# Altium project Cabinet.PrjPCB (part 1 of 2)
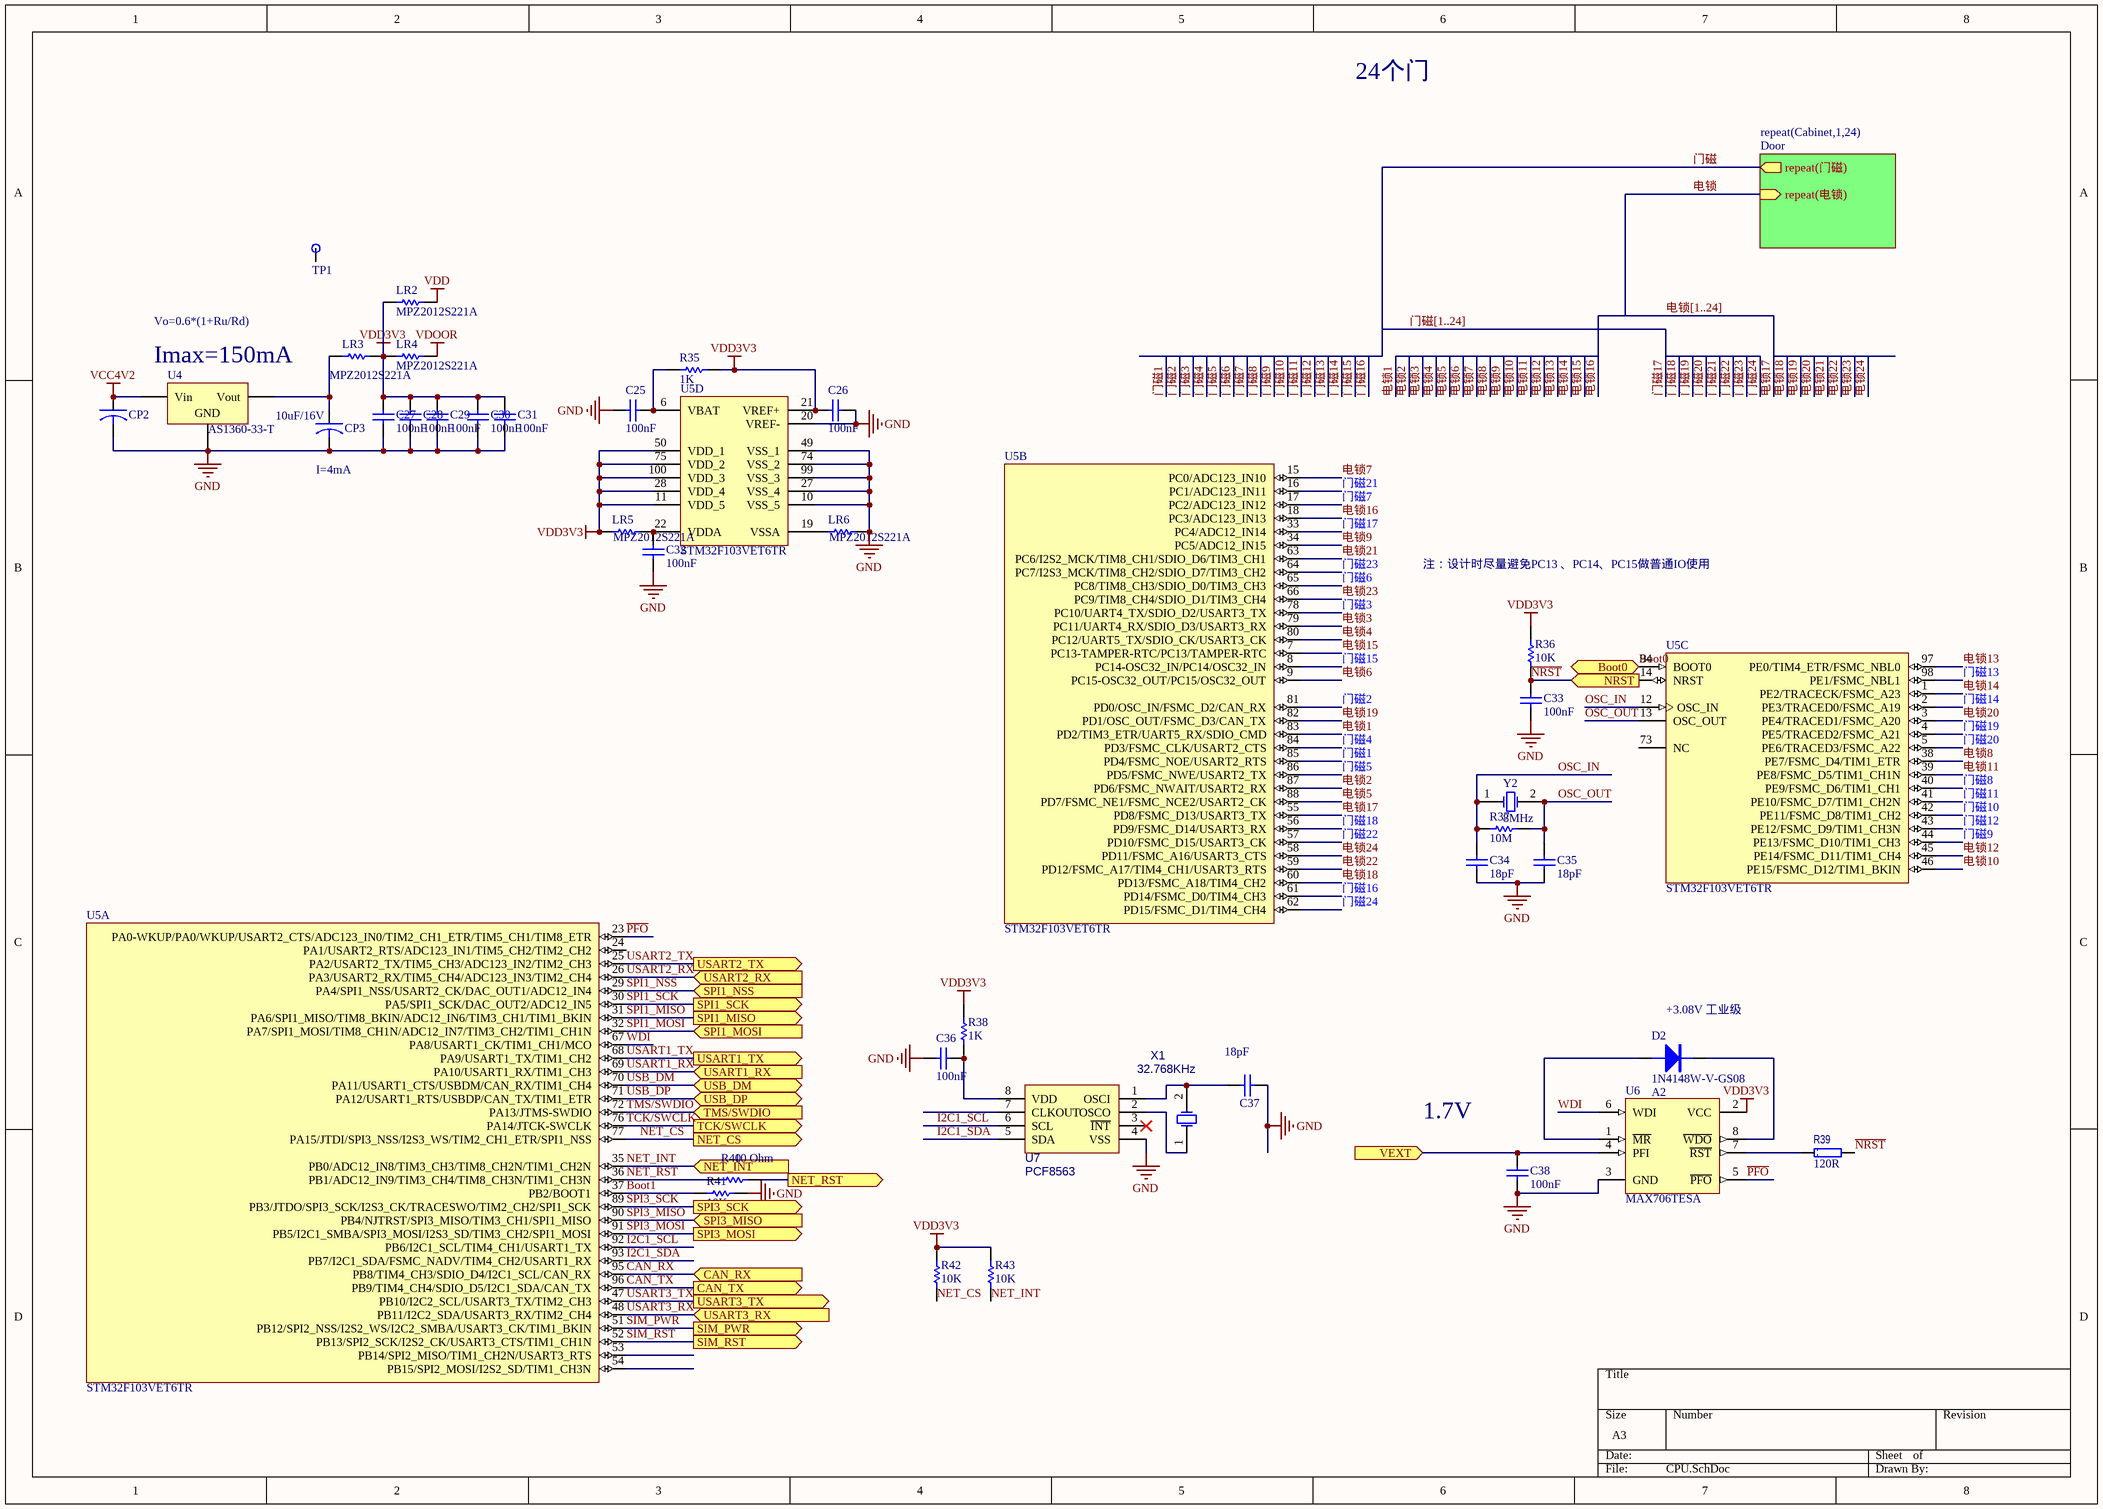
[diagram p0: CPU.SchDoc]
6 sheets, 506 parts. Net scope: hierarchical (ports join the sheet entries above them; power ports are global).
Board file: Cabinet_Device.PcbDoc
Sheets:
  CPU.SchDoc
    Cabinet1 = Door.SchDoc
    Cabinet2 = Door.SchDoc
    Cabinet3 = Door.SchDoc
    Cabinet4 = Door.SchDoc
    Cabinet5 = Door.SchDoc
    Cabinet6 = Door.SchDoc
    Cabinet7 = Door.SchDoc
    Cabinet8 = Door.SchDoc
    Cabinet9 = Door.SchDoc
    Cabinet10 = Door.SchDoc
    Cabinet11 = Door.SchDoc
    Cabinet12 = Door.SchDoc
    Cabinet13 = Door.SchDoc
    Cabinet14 = Door.SchDoc
    Cabinet15 = Door.SchDoc
    Cabinet16 = Door.SchDoc
    Cabinet17 = Door.SchDoc
    Cabinet18 = Door.SchDoc
    Cabinet19 = Door.SchDoc
    Cabinet20 = Door.SchDoc
    Cabinet21 = Door.SchDoc
    Cabinet22 = Door.SchDoc
    Cabinet23 = Door.SchDoc
    Cabinet24 = Door.SchDoc
  TAJ1051T.SchDoc
  W5500+HR911105A.SchDoc
  LM2596.SchDoc
  DownLoad.SchDoc

## Sheet CPU.SchDoc
size A3

### Parts
C25  value 100nF  [2012[0805]06CD]  (hidden comment: CAP 100nF 50V 0805(2012))
C26  value 100nF  [2012[0805]06CD]  (hidden comment: CAP 100nF 50V 0805(2012))
C27  value 100nF  [2012[0805]06CD]  (hidden comment: CAP 100nF 50V 0805(2012))
C28  value 100nF  [2012[0805]06CD]  (hidden comment: CAP 100nF 50V 0805(2012))
C29  value 100nF  [2012[0805]06CD]  (hidden comment: CAP 100nF 50V 0805(2012))
C30  value 100nF  [2012[0805]06CD]  (hidden comment: CAP 100nF 50V 0805(2012))
C31  value 100nF  [2012[0805]06CD]  (hidden comment: CAP 100nF 50V 0805(2012))
C32  value 100nF  [2012[0805]06CD]  (hidden comment: CAP 100nF 50V 0805(2012))
C33  value 100nF  [2012[0805]06CD]  (hidden comment: CAP 100nF 50V 0805(2012))
C34  value 18pF  [2012[0805]100_L]  (hidden comment: CAP 18pF 50V 0805(2012))
C35  value 18pF  [2012[0805]100_L]  (hidden comment: CAP 18pF 50V 0805(2012))
C36  value 100nF  [2012[0805]06CD]  (hidden comment: CAP 100nF 50V 0805(2012))
C37  value 18pF  [2012[0805]100_L]  (hidden comment: CAP 18pF 50V 0805(2012))
C38  value 100nF  [2012[0805]06CD]  (hidden comment: CAP 100nF 50V 0805(2012))
CP2  TAJA106K016RNJ  [3216[1206]CB]  (value not drawn)
CP3  value 10uF/16V  [3216[1206]CB]  (hidden comment: TAJA106K016RNJ)
D2  1N4148W-V-GS08  value A2  [SOD123]
LR2  MPZ2012S221A  [2012[0805]RL]
LR3  MPZ2012S221A  [2012[0805]RL]
LR4  MPZ2012S221A  [2012[0805]RL]
LR5  MPZ2012S221A  [2012[0805]RL]
LR6  MPZ2012S221A  [2012[0805]RL]
R35  value 1K  [2012[0805]R]  (hidden comment: 1K 1% 0805(2012))
R36  value 10K  [2012[0805]R]  (hidden comment: 10K 1% 0805(2012))
R37  value 10M  [2012[0805]R]  (hidden comment: 10M 1% 0805(2012))
R38  value 1K  [2012[0805]R]  (hidden comment: 1K 1% 0805(2012))
R39  value 120R  [2012[0805]R]  (hidden comment: CRCW0603120RFKEA)
R40  value 10 Ohm  [2012[0805]R]  (hidden comment: 10R 5% 0805(2012))
R41  value 10K  [2012[0805]R]  (hidden comment: 10K 1% 0805(2012))
R42  value 10K  [2012[0805]R]  (hidden comment: 10K 1% 0805(2012))
R43  value 10K  [2012[0805]R]  (hidden comment: 10K 1% 0805(2012))
TP1  TP  [TP]  (value not drawn)
U4  AS1360-33-T  [SOT23_N]
U5  STM32F103VET6TR  [STM-LQFP100_M]  (parts A,B,C,D of 4)
U6  MAX706TESA  [SOIC8_N]
U7  PCF8563  [SOIC8_N]
X1  32.768KHz  [XTAL32]
Y2  8MHz  [XTAL_HC-49]

### Sub-sheets
repeat(Cabinet,1,24) = Door: repeat(门磁) (out), repeat(电锁) (in)

### Ports
Boot0 (in), CAN_RX (in), CAN_TX (out), NET_CS (out), NET_INT (in), NET_RST (out), NRST (in), SIM_PWR (out), SIM_RST (out), SPI1_MISO (out), SPI1_MOSI (in), SPI1_NSS (in), SPI1_SCK (out), SPI3_MISO (in), SPI3_MOSI (out), SPI3_SCK (out), TCK/SWCLK (out), TMS/SWDIO (in), USART1_RX (in), USART1_TX (out), USART2_RX (in), USART2_TX (out), USART3_RX (in), USART3_TX (out), USB_DM, USB_DP, VEXT (in)

### Nets
GND: C25.2 C26.2 C27.2 C28.2 C29.2 C30.2 C31.2 C32.2 C33.2 C34.2 C35.2 C36.2 C37.2 C38.2 CP2.2 CP3.2 LR6.2 R41.1 U4.1(GND) U5.10(VSS_5) U5.20(VREF-) U5.27(VSS_4) U5.49(VSS_1) U5.74(VSS_2) U5.99(VSS_3) U6.3(GND) U7.4(VSS)
VCC4V2: CP2.1 U4.3(Vin)
VDD: LR2.2
VDD3V3: C26.1 C27.1 C28.1 C29.1 C30.1 C31.1 LR2.1 LR3.1 LR4.1 LR5.1 R35.1 R36.2 R38.1 R42.1 R43.1 U5.11(VDD_5) U5.21(VREF+) U5.28(VDD_4) U5.50(VDD_1) U5.75(VDD_2) U5.100(VDD_3) U6.2(VCC)
VDOOR: LR4.2
Boot0: U5.94(BOOT0) ; port Boot0
Boot1: R41.2 U5.37(PB2/BOOT1)
CAN_RX: U5.95(PB8/TIM4_CH3/SDIO_D4/I2C1_SCL/CAN_RX) ; port CAN_RX
CAN_TX: U5.96(PB9/TIM4_CH4/SDIO_D5/I2C1_SDA/CAN_TX) ; port CAN_TX
I2C1_SCL: U5.92(PB6/I2C1_SCL/TIM4_CH1/USART1_TX) U7.6(SCL)
I2C1_SDA: U5.93(PB7/I2C1_SDA/FSMC_NADV/TIM4_CH2/USART1_RX) U7.5(SDA)
~{NRST}: C33.1 R36.1 R39.2 U5.14(NRST) ; port NRST
NET_CS: R42.2 U5.77(PA15/JTDI/SPI3_NSS/I2S3_WS/TIM2_CH1_ETR/SPI1_NSS) ; port NET_CS
NET_INT: R43.2 U5.35(PB0/ADC12_IN8/TIM3_CH3/TIM8_CH2N/TIM1_CH2N) ; port NET_INT
NET_RST: R40.2 U5.36(PB1/ADC12_IN9/TIM3_CH4/TIM8_CH3N/TIM1_CH3N)
OSC_IN: C34.1 R37.1 U5.12(OSC_IN) Y2.1(OSC1)
OSC_OUT: C35.1 R37.2 U5.13(OSC_OUT) Y2.2(OSC2)
~{PFO}: U5.23(PA0-WKUP/PA0/WKUP/USART2_CTS/ADC123_IN0/TIM2_CH1_ETR/TIM5_CH1/TIM8_ETR) U6.5(~{PFO})
SIM_PWR: U5.51(PB12/SPI2_NSS/I2S2_WS/I2C2_SMBA/USART3_CK/TIM1_BKIN) ; port SIM_PWR
SIM_RST: U5.52(PB13/SPI2_SCK/I2S2_CK/USART3_CTS/TIM1_CH1N) ; port SIM_RST
SPI1_MISO: U5.31(PA6/SPI1_MISO/TIM8_BKIN/ADC12_IN6/TIM3_CH1/TIM1_BKIN) ; port SPI1_MISO
SPI1_MOSI: U5.32(PA7/SPI1_MOSI/TIM8_CH1N/ADC12_IN7/TIM3_CH2/TIM1_CH1N) ; port SPI1_MOSI
SPI1_NSS: U5.29(PA4/SPI1_NSS/USART2_CK/DAC_OUT1/ADC12_IN4) ; port SPI1_NSS
SPI1_SCK: U5.30(PA5/SPI1_SCK/DAC_OUT2/ADC12_IN5) ; port SPI1_SCK
SPI3_MISO: U5.90(PB4/NJTRST/SPI3_MISO/TIM3_CH1/SPI1_MISO) ; port SPI3_MISO
SPI3_MOSI: U5.91(PB5/I2C1_SMBA/SPI3_MOSI/I2S3_SD/TIM3_CH2/SPI1_MOSI) ; port SPI3_MOSI
SPI3_SCK: U5.89(PB3/JTDO/SPI3_SCK/I2S3_CK/TRACESWO/TIM2_CH2/SPI1_SCK) ; port SPI3_SCK
TCK/SWCLK: U5.76(PA14/JTCK-SWCLK) ; port TCK/SWCLK
TMS/SWDIO: U5.72(PA13/JTMS-SWDIO) ; port TMS/SWDIO
USART1_RX: U5.69(PA10/USART1_RX/TIM1_CH3) ; port USART1_RX
USART1_TX: U5.68(PA9/USART1_TX/TIM1_CH2) ; port USART1_TX
USART2_RX: U5.26(PA3/USART2_RX/TIM5_CH4/ADC123_IN3/TIM2_CH4) ; port USART2_RX
USART2_TX: U5.25(PA2/USART2_TX/TIM5_CH3/ADC123_IN2/TIM2_CH3) ; port USART2_TX
USART3_RX: U5.48(PB11/I2C2_SDA/USART3_RX/TIM2_CH4) ; port USART3_RX
USART3_TX: U5.47(PB10/I2C2_SCL/USART3_TX/TIM2_CH3) ; port USART3_TX
USB_DM: U5.70(PA11/USART1_CTS/USBDM/CAN_RX/TIM1_CH4) ; port USB_DM
USB_DP: U5.71(PA12/USART1_RTS/USBDP/CAN_TX/TIM1_ETR) ; port USB_DP
WDI: U5.67(PA8/USART1_CK/TIM1_CH1/MCO) U6.6(WDI)
电锁: sheet repeat(Cabinet,1,24)/repeat(电锁)
电锁1: U5.83(PD2/TIM3_ETR/UART5_RX/SDIO_CMD)
电锁2: U5.87(PD6/FSMC_NWAIT/USART2_RX)
电锁3: U5.79(PC11/UART4_RX/SDIO_D3/USART3_RX)
电锁4: U5.80(PC12/UART5_TX/SDIO_CK/USART3_CK)
电锁5: U5.88(PD7/FSMC_NE1/FSMC_NCE2/USART2_CK)
电锁6: U5.9(PC15-OSC32_OUT/PC15/OSC32_OUT)
电锁7: U5.15(PC0/ADC123_IN10)
电锁8: U5.38(PE7/FSMC_D4/TIM1_ETR)
电锁9: U5.34(PC5/ADC12_IN15)
电锁10: U5.46(PE15/FSMC_D12/TIM1_BKIN)
电锁11: U5.39(PE8/FSMC_D5/TIM1_CH1N)
电锁12: U5.45(PE14/FSMC_D11/TIM1_CH4)
电锁13: U5.97(PE0/TIM4_ETR/FSMC_NBL0)
电锁14: U5.1(PE2/TRACECK/FSMC_A23)
电锁15: U5.7(PC13-TAMPER-RTC/PC13/TAMPER-RTC)
电锁16: U5.18(PC3/ADC123_IN13)
电锁17: U5.55(PD8/FSMC_D13/USART3_TX)
电锁18: U5.60(PD13/FSMC_A18/TIM4_CH2)
电锁19: U5.82(PD1/OSC_OUT/FSMC_D3/CAN_TX)
电锁20: U5.3(PE4/TRACED1/FSMC_A20)
电锁21: U5.63(PC6/I2S2_MCK/TIM8_CH1/SDIO_D6/TIM3_CH1)
电锁22: U5.59(PD12/FSMC_A17/TIM4_CH1/USART3_RTS)
电锁23: U5.66(PC9/TIM8_CH4/SDIO_D1/TIM3_CH4)
电锁24: U5.58(PD11/FSMC_A16/USART3_CTS)
门磁: sheet repeat(Cabinet,1,24)/repeat(门磁)
门磁1: U5.85(PD4/FSMC_NOE/USART2_RTS)
门磁2: U5.81(PD0/OSC_IN/FSMC_D2/CAN_RX)
门磁3: U5.78(PC10/UART4_TX/SDIO_D2/USART3_TX)
门磁4: U5.84(PD3/FSMC_CLK/USART2_CTS)
门磁5: U5.86(PD5/FSMC_NWE/USART2_TX)
门磁6: U5.65(PC8/TIM8_CH3/SDIO_D0/TIM3_CH3)
门磁7: U5.17(PC2/ADC123_IN12)
门磁8: U5.40(PE9/FSMC_D6/TIM1_CH1)
门磁9: U5.44(PE13/FSMC_D10/TIM1_CH3)
门磁10: U5.42(PE11/FSMC_D8/TIM1_CH2)
门磁11: U5.41(PE10/FSMC_D7/TIM1_CH2N)
门磁12: U5.43(PE12/FSMC_D9/TIM1_CH3N)
门磁13: U5.98(PE1/FSMC_NBL1)
门磁14: U5.2(PE3/TRACED0/FSMC_A19)
门磁15: U5.8(PC14-OSC32_IN/PC14/OSC32_IN)
门磁16: U5.61(PD14/FSMC_D0/TIM4_CH3)
门磁17: U5.33(PC4/ADC12_IN14)
门磁18: U5.56(PD9/FSMC_D14/USART3_RX)
门磁19: U5.4(PE5/TRACED2/FSMC_A21)
门磁20: U5.5(PE6/TRACED3/FSMC_A22)
门磁21: U5.16(PC1/ADC123_IN11)
门磁22: U5.57(PD10/FSMC_D15/USART3_CK)
门磁23: U5.64(PC7/I2S3_MCK/TIM8_CH2/SDIO_D7/TIM3_CH2)
门磁24: U5.62(PD15/FSMC_D1/TIM4_CH4)
NetC25_1: C25.1 R35.2 U5.6(VBAT)
NetC32_1: C32.1 LR5.2 U5.22(VDDA)
NetC36_1: C36.1 R38.2 U7.8(VDD)
NetC37_1: C37.1 U7.1(OSCI) X1.2(OSC2)
NetC38_1: C38.1 U6.4(PFI) ; port VEXT
NetCP3_1: CP3.1 LR3.2 U4.2(Vout)
NetD2_1: D2.1(A) U6.1(~{MR})
NetD2_2: D2.2(K) U6.8(~{WDO})
NetLR6_1: LR6.1 U5.19(VSSA)
NetR39_1: R39.1 U6.7(~{RST})
NetR40_1: R40.1 ; port NET_RST
NetU7_2: U7.2(OSCO) X1.1(OSC1)

Not connected (* = marked no-connect by the designer): TP1 1(TestPoint); U5 24(PA1/USART2_RTS/ADC123_IN1/TIM5_CH2/TIM2_CH2) 53(PB14/SPI2_MISO/TIM1_CH2N/USART3_RTS) 54(PB15/SPI2_MOSI/I2S2_SD/TIM1_CH3N) 73(NC); U7 3(~{INT})* 7(CLKOUT)

### Buses and harness runs
bus 电锁[1..24]
bus 门磁[1..24]

### Notes on the sheet
- 24个门
- (near U4) Imax=150mA
- Vo=0.6*(1+Ru/Rd)
- (near CP3) I=4mA
- 注：设计时尽量避免PC13 、PC14、PC15做普通IO使用
- (near D2) +3.08V 工业级
- 1.7V

### Library data of the parts
C25-C32 C36 = CMP-1036-04418-1: CAP 100nF 50V ±5% 0805 (2012 Metric) Thickness 1mm SMD; Case-EIA: 0805; Case-Metric: 2012; Tolerance: ±5%; Max Thickness: 1 mm; Technology: SMT; Rated Voltage: 50 V
C33 C38 = CMP-1036-04417-1: CAP 100nF 50V ±5% 0805 (2012 Metric) Thickness 1.45mm SMD; Case-Metric: 2012; Case-EIA: 0805; Max Thickness: 1.45 mm; Tolerance: ±5%; Rated Voltage: 50 V; Technology: SMT
C34 C35 C37 = CMP-1036-01136-1: CAP 18pF 50V ±1% 0805 (2012 Metric) Thickness 0.75mm SMD; Case-EIA: 0805; Case-Metric: 2012; Technology: SMT; Tolerance: ±1%; Max Thickness: 0.75 mm; Rated Voltage: 50 V
CP2 CP3 = CAPACITOR: 钽质电容器-固体SMD 16volts 10uF 10%; Manufacturer: AVX; ESR: 3 Ohms; 产品: Tantalum Solid Standard Grade - Other Various; 产品种类: SMD Tantalum Capacitors; 制造商库存号: A Case; 外壳代码 - in: 1206; 外壳代码 - mm: 3216; 封装 / 箱体: 1206 (3216 metric); 封装: Reel; 尺寸: 1.6 mm W x 3.2 mm L; 工作温度范围: - 55 C to + 125 C; 损耗因数 DF: 8; 标准包装数量: 2000; 漏泄电流: 1.6 uA; 电压额定值: 16 V; 端接类型: SMD/SMT; 系列: TAJ; 高度: 1.8 mm; Category: 钽质电容器-固体SMD; ComponentLink1Description: http://www.avx.com/docs/Catalogs/taj.pdf; ComponentLink1URL: http://www.avx.com/docs/Catalogs/taj.pdf; Description 1: 钽质电容器-固体SMD 16volts 10uF 10%; Manufacturer Part Number: TAJA106K016RNJ; Minimum Order Quantity: 1; Pricing 1: 1=0.600, 100=0.280, 200=0.250, 500=0.221, 1000=0.200, 2000=0.140, 5000=0.131, 10000=0.124, 25000=0.103 (USD); Reeling: True; RoHS - 贸泽: Y; RoHS: RoHS Compliant; Stock 1: 20335; Supplier 1: Mouser; Supplier Part Number 1: 581-TAJA106K016R; 制造商: AVX; 容差: 10 %; 电容: 10 uF
D2 = 1N4148W: 二极管 - 通用，功率，开关 100V Io/150mA; Manufacturer: Vishay Semiconductors; 配置: Single; 工作温度范围: - 65 C to + 150 C; 封装 / 箱体: SOD-123; 封装: Reel; 产品: Switching Diodes; 正向连续电流: 0.15 A; 最大浪涌电流: 0.5 A; 安装风格: SMD/SMT; 恢复时间: 4 ns; 正向电压下降: 1.2 V; 制造商: Vishay; 最大二极管电容: 4 pF; 最大工作温度: + 150 C; 最大功率耗散: 350 mW; 最大反向漏泄电流: 5 uA; 最小工作温度: - 65 C; 标准包装数量: 15000; Supplier 1: Mouser; Supplier Part Number 1: 625-1N4148W-V; Manufacturer Part Number: 1N4148W-V-GS08; RoHS: RoHS Compliant; Category: 二极管 - 通用，功率，开关; Stock 1: 404148; Pricing 1: 1=0.090, 10=0.083, 50=0.072, 100=0.068, 500=0.032, 1000=0.026, 3000=0.021, 9000=0.016, 10000=0.016, 18000=0.014 (USD); 峰值反向电压: 100 V; 产品种类: Switching Diodes; RoHS - 贸泽: Y; Minimum Order Quantity: 1; Reeling: True; ComponentLink1URL: http://www.mouser.com/ds/2/427/1n4148w--240387.pdf; ComponentLink1Description: http://www.mouser.com/ds/2/427/1n4148w--240387.pdf; Description 1: 二极管 - 通用，功率，开关 100V Io/150mA
LR2-LR6 = Res Semi: 电磁干扰滤波珠子、扼流圈和阵列 Ferrite Chip Beads; Manufacturer: TDK; 阻抗: 220 Ohms; 最大直流电流: 3 A; 最大直流电阻: 0.04 Ohms; 工作温度范围: - 55 C to + 125 C; 封装 / 箱体: 2012; 封装: Reel; 端接类型: SMD/SMT; 容差: 25 %; 产品种类: Ferrite Beads; 标准包装数量: 4000; Supplier 1: Mouser; Supplier Part Number 1: 810-MPZ2012S221A; Manufacturer Part Number: MPZ2012S221A; RoHS: RoHS Compliant; Description 1: 电磁干扰滤波珠子、扼流圈和阵列 Ferrite Chip Beads; Category: 电磁干扰滤波珠子、扼流圈和阵列; Stock 1: 26540; Pricing 1: 1=0.070, 50=0.060, 100=0.053, 500=0.040, 1000=0.035, 4000=0.031, 8000=0.029, 12000=0.025 (USD); 制造商: TDK; RoHS - 贸泽: Y; Minimum Order Quantity: 1; Reeling: True; ComponentLink1URL: http://www.mouser.com/ds/2/400/e9413_mpz-24582.pdf; ComponentLink1Description: http://www.mouser.com/ds/2/400/e9413_mpz-24582.pdf
R35 R38 = CMP-1013-00510-1: 1K 0.125W 1% 0805 (2012 Metric)  SMD; Case-Metric: 2012; Case-EIA: 0805; Tolerance: 1 %; Power: 0.125 W; Technology: SMT
R36 R41-R43 = CMP-1013-00623-1: 10K 0.125W 1% 0805 (2012 Metric)  SMD; Case-Metric: 2012; Case-EIA: 0805; Tolerance: 1 %; Power: 0.125 W; Technology: SMT
R37 = CMP-1013-00962-1: 10M 0.125W 1% 0805 (2012 Metric)  SMD; Case-EIA: 0805; Case-Metric: 2012; Tolerance: 1 %; Power: 0.125 W; Technology: SMT
R39 = RES: 厚膜电阻器 - SMD 1/10watt 120ohms 1%; Manufacturer: Vishay / Dale; 尺寸: 0.85 mm W x 1.55 mm L x 0.45 mm H; 工作温度范围: - 55 C to + 155 C; 封装 / 箱体: 0603 (1608 metric); 封装: Reel; 功率额定值: 100 mW; 产品: Thick Film Resistors SMD; 系列: CRCW; 温度系数: 100 PPM / K; 端接类型: SMD/SMT; 电压额定值: 75 V; 外壳代码 - in: 0603; 外壳代码 - mm: 1608; 制造商: Vishay; 产品种类: 0603 Thick Film Chip Resistors; 标准包装数量: 5000; Supplier 1: Mouser; Supplier Part Number 1: 71-CRCW0603-120-E3; Manufacturer Part Number: CRCW0603120RFKEA; RoHS: RoHS Compliant By Exemption; Category: 厚膜电阻器 - SMD; Stock 1: 11148; Pricing 1: 1=0.080, 10=0.013, 100=0.010, 1000=0.008, 5000=0.005, 25000=0.004, 50000=0.003 (USD); 电阻: 120 Ohms; 容差: 1 %; RoHS - 贸泽: E; Minimum Order Quantity: 1; Reeling: True; ComponentLink1URL: http://www.mouser.com/ds/2/427/dcrcwe3-109170.pdf; ComponentLink1Description: http://www.mouser.com/ds/2/427/dcrcwe3-109170.pdf; Description 1: 厚膜电阻器 - SMD 1/10watt 120ohms 1%
R40 = CMP-1013-00026-1: 10R 0.125W 5% 0805 (2012 Metric)  SMD; Case-EIA: 0805; Case-Metric: 2012; Technology: SMT; Power: 0.125 W; Tolerance: 5 %
TP1 = Test Point
U4 = Volt Reg: LDO Voltage Controllers; Manufacturer: ams; Input Voltage MAX: 20 V; Output Current: 150 mA; Output Voltage: 3.3 V; Product Status: New at Mouser; Supplier 1: Mouser; Supplier Part Number 1: 985-AS1360-33-T; Manufacturer Part Number: AS1360-33-T; RoHS: RoHS Compliant; Category: LDO Voltage Controllers; Stock 1: 4086; Pricing 1: 1=1.82, 10=1.46, 100=1.12, 500=0.991, 1000=0.783, 2500=0.730, 5000=0.695, 10000=0.680 (AUD); Package / Case: SOT-23-3; Packaging: Reel; Mounting Style: SMD/SMT; Maximum Operating Temperature: + 85 C; Minimum Operating Temperature: - 40 C; RoHS - Mouser: Y; Minimum Order Quantity: 1; Reeling: True; ComponentLink1URL: http://ams.com/eng/content/download/1325/7334/424; ComponentLink1Description: http://ams.com/eng/content/download/1325/7334/424
U5 = CMP-0237-00166-2: ARM Cortex-M3 32-bit MCU, 512 KB Flash, 64 KB Internal RAM, 80 I/Os, 100-pin LQFP, -40 to 85 degC, Tape and Reel; D/A Converter: 2x12-bit (2 Channel); I/Os (High Current): 80; Supply Voltage(Vcc) min (V): 2; Operating Frequency(F) (Processor speed) (MHz): 72; A/D Converter: 3x12-bit (16 Channel); FLASH Size (Prog) (kB): 512; Internal RAM Size (kB): 64; Mounting Technology: Surface Mount; ComponentLink2URL: http://www.st.com/st-web-ui/static/active/en/resource/technical/document/datasheet/CD00191185.pdf; ComponentLink1Description: Manufacturer URL; PackageReference: LQFP100; ComponentLink2Description: Datasheet; PackageVersion: Rev. 1, 06/2013; Core: ARM Cortex-M3; ComponentLink3URL: http://www.st.com/st-web-ui/static/active/en/resource/technical/document/data_brief/DM00071938.pdf; ComponentLink3Description: Package Specification; DatasheetVersion: Rev. 8; PartNumber: STM32F103VET6TR; Packing: Tape and Reel; ComponentLink1URL: http://www.st.com/web/en/home.html; PackageDescription: 100-Pin Low Profile Quad Flat Package, 14 x 14 mm Body, 0.5 mm Pitch
U6 = MAX706TESA: +3V Voltage Monitoring, Low-Cost, 礟 Supervisory Circuit; Published: 16-Jan-2001; LatestRevisionDate: 13-Apr-2006; LatestRevisionNote: IPC-7351 Footprint Added.; DatasheetVersion: Sep-1995; PackageReference: NSO8; Publisher: Altium Limited; PackageDescription: 8-Pin Small Outline Integrated Circuit 1.27 mm Pitch; Code_JEDEC: MS-012-AA; Code_IPC: SOIC127P600-8; ComponentLink1Description: Manufacturer Link; ComponentLink1URL: http://www.maxim-ic.com/; ComponentLink2Description: Datasheet; ComponentLink2URL: http://pdfserv.maxim-ic.com/en/ds/MAX706P-MAX708T.pdf
U7 = PCF8563: RTC时钟
X1 Y2 = XTAL: Crystal Oscillator
  X1: Published: *; LatestRevisionDate: *; LatestRevisionNote: *; PackageReference: *; Publisher: *
  Y2: Published: 8-Jun-2000; LatestRevisionDate: 17-Jul-2002; LatestRevisionNote: Re-released for DXP Platform.; Publisher: Altium Limited

## Sheet Door.SchDoc
size A4
Used 24 times, as channels Cabinet1, Cabinet2, Cabinet3, Cabinet4, Cabinet5, Cabinet6, Cabinet7, Cabinet8, Cabinet9, Cabinet10, Cabinet11, Cabinet12, Cabinet13, Cabinet14, Cabinet15, Cabinet16, Cabinet17, Cabinet18, Cabinet19, Cabinet20, Cabinet21, Cabinet22, Cabinet23, Cabinet24. Parts and nets are listed once, with the designators drawn on the sheet.
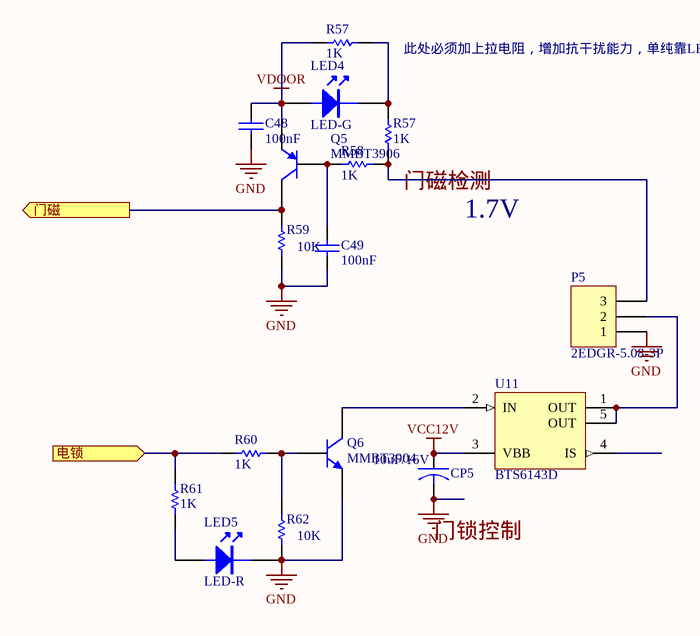
[diagram p1: Door.SchDoc]

### Parts
(Parts that share a designator on the sheet are numbered #1, #2 ... from top to bottom, then left to right.)
C48  value 100nF  [2012[0805]06CD]  (hidden comment: CAP 100nF 50V 0805(2012))
C49  value 100nF  [2012[0805]06CD]  (hidden comment: CAP 100nF 50V 0805(2012))
CP5  value 10uF/16V  [3216[1206]CB]  (hidden comment: TAJA106K016RNJ)
LED4  LED-G  [0805LED]
LED5  LED-R  [0805LED]
P5  2EDGR-5.08-3P  [2EDGR-5.08-3P]
Q5  MMBT3906  [SOT23B_N]
Q6  MMBT3904  [SOT23_N]
R57#1  value 1K  [2012[0805]R]  (hidden comment: 1K 1% 0805(2012))
R57#2  value 1K  [2012[0805]R]  (hidden comment: 1K 1% 0805(2012))
R58  value 1K  [2012[0805]R]  (hidden comment: 1K 1% 0805(2012))
R59  value 10K  [2012[0805]R]  (hidden comment: 10K 1% 0805(2012))
R60  value 1K  [2012[0805]R]  (hidden comment: 1K 1% 0805(2012))
R61  value 1K  [2012[0805]R]  (hidden comment: 1K 1% 0805(2012))
R62  value 10K  [2012[0805]R]  (hidden comment: 10K 1% 0805(2012))
U11  BTS6143D  [INF-PG-TO252-5-11_M]

### Ports
电锁 (in), 门磁 (out)

### Nets
GND: C48.2 C49.2 CP5.2 LED5.2 P5.1 Q6.2(E) R59.1 R62.1
VCC12V: CP5.1 U11.3(VBB)
VDOOR: C48.1 LED4.1 Q5.2(E) R57#1.2
电锁: R60.2 R61.1 ; port 电锁
门磁: Q5.3(C) R59.2 ; port 门磁
NetC49_1: C49.1 Q5.1(B) R58.1
NetLED4_2: LED4.2 R57#1.1 R57#2.2
NetLED5_1: LED5.1 R61.2
NetP5_2: P5.2 U11.1(OUT) U11.5(OUT)
NetP5_3: P5.3 R57#2.1 R58.2
NetQ6_1: Q6.1(B) R60.1 R62.2
NetQ6_3: Q6.3(C) U11.2(IN)

Not connected (* = marked no-connect by the designer): U11 4(IS)

### Channels
Cabinet1: designators C48=C48_Cabinet1 C49=C49_Cabinet1 CP5=CP5_Cabinet1 LED4=LED4_Cabinet1 LED5=LED5_Cabinet1 P5=P5_Cabinet1 Q5=Q5_Cabinet1 Q6=Q6_Cabinet1 R57=R57_Cabinet1#2 R57=R57_Cabinet1#1 R58=R58_Cabinet1 R59=R59_Cabinet1 R60=R60_Cabinet1 R61=R61_Cabinet1 R62=R62_Cabinet1 U11=U11_Cabinet1; ports 电锁=电锁1 门磁=门磁1
Cabinet2: designators C48=C48_Cabinet2 C49=C49_Cabinet2 CP5=CP5_Cabinet2 LED4=LED4_Cabinet2 LED5=LED5_Cabinet2 P5=P5_Cabinet2 Q5=Q5_Cabinet2 Q6=Q6_Cabinet2 R57=R57_Cabinet2#2 R57=R57_Cabinet2#1 R58=R58_Cabinet2 R59=R59_Cabinet2 R60=R60_Cabinet2 R61=R61_Cabinet2 R62=R62_Cabinet2 U11=U11_Cabinet2; ports 电锁=电锁2 门磁=门磁2
Cabinet3: designators C48=C48_Cabinet3 C49=C49_Cabinet3 CP5=CP5_Cabinet3 LED4=LED4_Cabinet3 LED5=LED5_Cabinet3 P5=P5_Cabinet3 Q5=Q5_Cabinet3 Q6=Q6_Cabinet3 R57=R57_Cabinet3#2 R57=R57_Cabinet3#1 R58=R58_Cabinet3 R59=R59_Cabinet3 R60=R60_Cabinet3 R61=R61_Cabinet3 R62=R62_Cabinet3 U11=U11_Cabinet3; ports 电锁=电锁3 门磁=门磁3
Cabinet4: designators C48=C48_Cabinet4 C49=C49_Cabinet4 CP5=CP5_Cabinet4 LED4=LED4_Cabinet4 LED5=LED5_Cabinet4 P5=P5_Cabinet4 Q5=Q5_Cabinet4 Q6=Q6_Cabinet4 R57=R57_Cabinet4#2 R57=R57_Cabinet4#1 R58=R58_Cabinet4 R59=R59_Cabinet4 R60=R60_Cabinet4 R61=R61_Cabinet4 R62=R62_Cabinet4 U11=U11_Cabinet4; ports 电锁=电锁4 门磁=门磁4
Cabinet5: designators C48=C48_Cabinet5 C49=C49_Cabinet5 CP5=CP5_Cabinet5 LED4=LED4_Cabinet5 LED5=LED5_Cabinet5 P5=P5_Cabinet5 Q5=Q5_Cabinet5 Q6=Q6_Cabinet5 R57=R57_Cabinet5#2 R57=R57_Cabinet5#1 R58=R58_Cabinet5 R59=R59_Cabinet5 R60=R60_Cabinet5 R61=R61_Cabinet5 R62=R62_Cabinet5 U11=U11_Cabinet5; ports 电锁=电锁5 门磁=门磁5
Cabinet6: designators C48=C48_Cabinet6 C49=C49_Cabinet6 CP5=CP5_Cabinet6 LED4=LED4_Cabinet6 LED5=LED5_Cabinet6 P5=P5_Cabinet6 Q5=Q5_Cabinet6 Q6=Q6_Cabinet6 R57=R57_Cabinet6#2 R57=R57_Cabinet6#1 R58=R58_Cabinet6 R59=R59_Cabinet6 R60=R60_Cabinet6 R61=R61_Cabinet6 R62=R62_Cabinet6 U11=U11_Cabinet6; ports 电锁=电锁6 门磁=门磁6
Cabinet7: designators C48=C48_Cabinet7 C49=C49_Cabinet7 CP5=CP5_Cabinet7 LED4=LED4_Cabinet7 LED5=LED5_Cabinet7 P5=P5_Cabinet7 Q5=Q5_Cabinet7 Q6=Q6_Cabinet7 R57=R57_Cabinet7#2 R57=R57_Cabinet7#1 R58=R58_Cabinet7 R59=R59_Cabinet7 R60=R60_Cabinet7 R61=R61_Cabinet7 R62=R62_Cabinet7 U11=U11_Cabinet7; ports 电锁=电锁7 门磁=门磁7
Cabinet8: designators C48=C48_Cabinet8 C49=C49_Cabinet8 CP5=CP5_Cabinet8 LED4=LED4_Cabinet8 LED5=LED5_Cabinet8 P5=P5_Cabinet8 Q5=Q5_Cabinet8 Q6=Q6_Cabinet8 R57=R57_Cabinet8#2 R57=R57_Cabinet8#1 R58=R58_Cabinet8 R59=R59_Cabinet8 R60=R60_Cabinet8 R61=R61_Cabinet8 R62=R62_Cabinet8 U11=U11_Cabinet8; ports 电锁=电锁8 门磁=门磁8
Cabinet9: designators C48=C48_Cabinet9 C49=C49_Cabinet9 CP5=CP5_Cabinet9 LED4=LED4_Cabinet9 LED5=LED5_Cabinet9 P5=P5_Cabinet9 Q5=Q5_Cabinet9 Q6=Q6_Cabinet9 R57=R57_Cabinet9#2 R57=R57_Cabinet9#1 R58=R58_Cabinet9 R59=R59_Cabinet9 R60=R60_Cabinet9 R61=R61_Cabinet9 R62=R62_Cabinet9 U11=U11_Cabinet9; ports 电锁=电锁9 门磁=门磁9
Cabinet10: designators C48=C48_Cabinet10 C49=C49_Cabinet10 CP5=CP5_Cabinet10 LED4=LED4_Cabinet10 LED5=LED5_Cabinet10 P5=P5_Cabinet10 Q5=Q5_Cabinet10 Q6=Q6_Cabinet10 R57=R57_Cabinet10#2 R57=R57_Cabinet10#1 R58=R58_Cabinet10 R59=R59_Cabinet10 R60=R60_Cabinet10 R61=R61_Cabinet10 R62=R62_Cabinet10 U11=U11_Cabinet10; ports 电锁=电锁10 门磁=门磁10
Cabinet11: designators C48=C48_Cabinet11 C49=C49_Cabinet11 CP5=CP5_Cabinet11 LED4=LED4_Cabinet11 LED5=LED5_Cabinet11 P5=P5_Cabinet11 Q5=Q5_Cabinet11 Q6=Q6_Cabinet11 R57=R57_Cabinet11#2 R57=R57_Cabinet11#1 R58=R58_Cabinet11 R59=R59_Cabinet11 R60=R60_Cabinet11 R61=R61_Cabinet11 R62=R62_Cabinet11 U11=U11_Cabinet11; ports 电锁=电锁11 门磁=门磁11
Cabinet12: designators C48=C48_Cabinet12 C49=C49_Cabinet12 CP5=CP5_Cabinet12 LED4=LED4_Cabinet12 LED5=LED5_Cabinet12 P5=P5_Cabinet12 Q5=Q5_Cabinet12 Q6=Q6_Cabinet12 R57=R57_Cabinet12#2 R57=R57_Cabinet12#1 R58=R58_Cabinet12 R59=R59_Cabinet12 R60=R60_Cabinet12 R61=R61_Cabinet12 R62=R62_Cabinet12 U11=U11_Cabinet12; ports 电锁=电锁12 门磁=门磁12
Cabinet13: designators C48=C48_Cabinet13 C49=C49_Cabinet13 CP5=CP5_Cabinet13 LED4=LED4_Cabinet13 LED5=LED5_Cabinet13 P5=P5_Cabinet13 Q5=Q5_Cabinet13 Q6=Q6_Cabinet13 R57=R57_Cabinet13#2 R57=R57_Cabinet13#1 R58=R58_Cabinet13 R59=R59_Cabinet13 R60=R60_Cabinet13 R61=R61_Cabinet13 R62=R62_Cabinet13 U11=U11_Cabinet13; ports 电锁=电锁13 门磁=门磁13
Cabinet14: designators C48=C48_Cabinet14 C49=C49_Cabinet14 CP5=CP5_Cabinet14 LED4=LED4_Cabinet14 LED5=LED5_Cabinet14 P5=P5_Cabinet14 Q5=Q5_Cabinet14 Q6=Q6_Cabinet14 R57=R57_Cabinet14#2 R57=R57_Cabinet14#1 R58=R58_Cabinet14 R59=R59_Cabinet14 R60=R60_Cabinet14 R61=R61_Cabinet14 R62=R62_Cabinet14 U11=U11_Cabinet14; ports 电锁=电锁14 门磁=门磁14
Cabinet15: designators C48=C48_Cabinet15 C49=C49_Cabinet15 CP5=CP5_Cabinet15 LED4=LED4_Cabinet15 LED5=LED5_Cabinet15 P5=P5_Cabinet15 Q5=Q5_Cabinet15 Q6=Q6_Cabinet15 R57=R57_Cabinet15#2 R57=R57_Cabinet15#1 R58=R58_Cabinet15 R59=R59_Cabinet15 R60=R60_Cabinet15 R61=R61_Cabinet15 R62=R62_Cabinet15 U11=U11_Cabinet15; ports 电锁=电锁15 门磁=门磁15
Cabinet16: designators C48=C48_Cabinet16 C49=C49_Cabinet16 CP5=CP5_Cabinet16 LED4=LED4_Cabinet16 LED5=LED5_Cabinet16 P5=P5_Cabinet16 Q5=Q5_Cabinet16 Q6=Q6_Cabinet16 R57=R57_Cabinet16#2 R57=R57_Cabinet16#1 R58=R58_Cabinet16 R59=R59_Cabinet16 R60=R60_Cabinet16 R61=R61_Cabinet16 R62=R62_Cabinet16 U11=U11_Cabinet16; ports 电锁=电锁16 门磁=门磁16
Cabinet17: designators C48=C48_Cabinet17 C49=C49_Cabinet17 CP5=CP5_Cabinet17 LED4=LED4_Cabinet17 LED5=LED5_Cabinet17 P5=P5_Cabinet17 Q5=Q5_Cabinet17 Q6=Q6_Cabinet17 R57=R57_Cabinet17#2 R57=R57_Cabinet17#1 R58=R58_Cabinet17 R59=R59_Cabinet17 R60=R60_Cabinet17 R61=R61_Cabinet17 R62=R62_Cabinet17 U11=U11_Cabinet17; ports 电锁=电锁17 门磁=门磁17
Cabinet18: designators C48=C48_Cabinet18 C49=C49_Cabinet18 CP5=CP5_Cabinet18 LED4=LED4_Cabinet18 LED5=LED5_Cabinet18 P5=P5_Cabinet18 Q5=Q5_Cabinet18 Q6=Q6_Cabinet18 R57=R57_Cabinet18#2 R57=R57_Cabinet18#1 R58=R58_Cabinet18 R59=R59_Cabinet18 R60=R60_Cabinet18 R61=R61_Cabinet18 R62=R62_Cabinet18 U11=U11_Cabinet18; ports 电锁=电锁18 门磁=门磁18
Cabinet19: designators C48=C48_Cabinet19 C49=C49_Cabinet19 CP5=CP5_Cabinet19 LED4=LED4_Cabinet19 LED5=LED5_Cabinet19 P5=P5_Cabinet19 Q5=Q5_Cabinet19 Q6=Q6_Cabinet19 R57=R57_Cabinet19#2 R57=R57_Cabinet19#1 R58=R58_Cabinet19 R59=R59_Cabinet19 R60=R60_Cabinet19 R61=R61_Cabinet19 R62=R62_Cabinet19 U11=U11_Cabinet19; ports 电锁=电锁19 门磁=门磁19
Cabinet20: designators C48=C48_Cabinet20 C49=C49_Cabinet20 CP5=CP5_Cabinet20 LED4=LED4_Cabinet20 LED5=LED5_Cabinet20 P5=P5_Cabinet20 Q5=Q5_Cabinet20 Q6=Q6_Cabinet20 R57=R57_Cabinet20#2 R57=R57_Cabinet20#1 R58=R58_Cabinet20 R59=R59_Cabinet20 R60=R60_Cabinet20 R61=R61_Cabinet20 R62=R62_Cabinet20 U11=U11_Cabinet20; ports 电锁=电锁20 门磁=门磁20
Cabinet21: designators C48=C48_Cabinet21 C49=C49_Cabinet21 CP5=CP5_Cabinet21 LED4=LED4_Cabinet21 LED5=LED5_Cabinet21 P5=P5_Cabinet21 Q5=Q5_Cabinet21 Q6=Q6_Cabinet21 R57=R57_Cabinet21#2 R57=R57_Cabinet21#1 R58=R58_Cabinet21 R59=R59_Cabinet21 R60=R60_Cabinet21 R61=R61_Cabinet21 R62=R62_Cabinet21 U11=U11_Cabinet21; ports 电锁=电锁21 门磁=门磁21
Cabinet22: designators C48=C48_Cabinet22 C49=C49_Cabinet22 CP5=CP5_Cabinet22 LED4=LED4_Cabinet22 LED5=LED5_Cabinet22 P5=P5_Cabinet22 Q5=Q5_Cabinet22 Q6=Q6_Cabinet22 R57=R57_Cabinet22#2 R57=R57_Cabinet22#1 R58=R58_Cabinet22 R59=R59_Cabinet22 R60=R60_Cabinet22 R61=R61_Cabinet22 R62=R62_Cabinet22 U11=U11_Cabinet22; ports 电锁=电锁22 门磁=门磁22
Cabinet23: designators C48=C48_Cabinet23 C49=C49_Cabinet23 CP5=CP5_Cabinet23 LED4=LED4_Cabinet23 LED5=LED5_Cabinet23 P5=P5_Cabinet23 Q5=Q5_Cabinet23 Q6=Q6_Cabinet23 R57=R57_Cabinet23#2 R57=R57_Cabinet23#1 R58=R58_Cabinet23 R59=R59_Cabinet23 R60=R60_Cabinet23 R61=R61_Cabinet23 R62=R62_Cabinet23 U11=U11_Cabinet23; ports 电锁=电锁23 门磁=门磁23
Cabinet24: designators C48=C48_Cabinet24 C49=C49_Cabinet24 CP5=CP5_Cabinet24 LED4=LED4_Cabinet24 LED5=LED5_Cabinet24 P5=P5_Cabinet24 Q5=Q5_Cabinet24 Q6=Q6_Cabinet24 R57=R57_Cabinet24#2 R57=R57_Cabinet24#1 R58=R58_Cabinet24 R59=R59_Cabinet24 R60=R60_Cabinet24 R61=R61_Cabinet24 R62=R62_Cabinet24 U11=U11_Cabinet24; ports 电锁=电锁24 门磁=门磁24

### Notes on the sheet
- (near R57#1) 此处必须加上拉电阻，增加抗干扰能力，单纯靠LED的上拉不起作用
- 门磁检测
- 1.7V
- (near CP5) 门锁控制

### Library data of the parts
C48 C49 = CMP-1036-04418-1: as C25 on sheet CPU; Tolerance: ±5%; Max Thickness: 1 mm; Technology: SMT; Rated Voltage: 50 V
CP5 = CAPACITOR: as CP2 on sheet CPU; Category: 钽质电容器-固体SMD; ComponentLink1Description: http://www.avx.com/docs/Catalogs/taj.pdf; ComponentLink1URL: http://www.avx.com/docs/Catalogs/taj.pdf; Description 1: 钽质电容器-固体SMD 16volts 10uF 10%; Manufacturer Part Number: TAJA106K016RNJ; Minimum Order Quantity: 1; Pricing 1: 1=0.600, 100=0.280, 200=0.250, 500=0.221, 1000=0.200, 2000=0.140, 5000=0.131, 10000=0.124, 25000=0.103 (USD); Reeling: True; RoHS - 贸泽: Y; RoHS: RoHS Compliant; Stock 1: 20335; Supplier 1: Mouser; Supplier Part Number 1: 581-TAJA106K016R; 制造商: AVX; 容差: 10 %; 电容: 10 uF
LED4 = LED: 绿色LED
LED5 = LED: 红色LED
P5 = Header 3: Header, 3-Pin; LatestRevisionDate: 17-Jul-2002; LatestRevisionNote: Re-released for DXP Platform.; Publisher: Altium Limited
Q5 = MMBT3906: PNP Switching Transistor; Published: 17-Sep-2003; LatestRevisionDate: 12-Dec-2006; LatestRevisionNote: IPC-7351 Footprint Added.; DatasheetVersion: 11-Apr-2000; PackageVersion: May-1999; PackageReference: SOT23; Publisher: Altium Limited; PackageDescription: 3-Pin SOT-23 Package 0.95 mm Pitch, 2.3 mm Lead Span; ComponentLink1Description: Manufacturer Link; ComponentLink1URL: http://www.semiconductors.philips.com/; ComponentLink2Description: Datasheet; ComponentLink2URL: http://www.semiconductors.philips.com/acrobat/datasheets/MMBT3906_2.pdf
Q6 = MMBT3904: NPN Switching Transistor; Published: 17-Sep-2003; LatestRevisionDate: 12-Dec-2006; LatestRevisionNote: IPC-7351 Footprint Added.; DatasheetVersion: 13-May-2002; PackageVersion: May-1999; PackageReference: SOT23; Publisher: Altium Limited; PackageDescription: 3-Pin SOT-23 Package 0.95 mm Pitch, 2.3 mm Lead Span; ComponentLink1Description: Manufacturer Link; ComponentLink1URL: http://www.semiconductors.philips.com/; ComponentLink2Description: Datasheet; ComponentLink2URL: http://www.semiconductors.philips.com/acrobat/datasheets/MMBT3904_4.pdf
R57#1 R57#2 R58 R60 R61 = CMP-1013-00510-1: as R35 on sheet CPU; Tolerance: 1 %; Power: 0.125 W; Technology: SMT
R59 R62 = CMP-1013-00623-1: as R36 on sheet CPU; Tolerance: 1 %; Power: 0.125 W; Technology: SMT
U11 = CMP-1095-00112-1: PROFET Smart Highside Power Switch, 1 Channel, 10 A Load Current, -40 to 150 degC, PG-TO252-5-11, Reel, Green; Manufacturer: Infineon; Recommended Operating Voltage Min.: 5.5 V; RON(max) @ 150degreesC: 18 mOhm; toff (max): 500 us; Load Current (typ): 10 A; RON @ 25degreesC: 10 mOhm; Recommended Operating Voltage Max.: 38 V; Green: TRUE; Ptot (max): 59 W; Group: Automotive Qualified; Channels: 1; Packing: Reel; ComponentLink1URL: http://www.infineon.com/; PartNumber: BTS6143D; Mounting Technology: Surface Mount; ComponentLink2Description: Datasheet; ComponentLink3URL: http://www.infineon.com/dgdl/TLE7276-Data+Sheet-+v1_11.pdf?folderId=db3a304412b407950112b408e8c90004&fileId=db3a304412b407950112b436c53f66c8&sId=db3a30433db6f09f013dc0e43c0428c1; ComponentLink3Description: Package Specification; ComponentLink2URL: http://www.infineon.com/dgdl/BTS6143D_DS_v10.pdf?folderId=db3a304314dca389011537739e37155f&fileId=db3a3043183a95550118606a2705368e&location=en.Products.Automotive_ICs.Smart_High-_and_Low-Side_Switches.PROFET__-_Smart_High_Side_Switches.DATASHEET.BTS6143D_D; ComponentLink1Description: Manufacturer URL; PackageVersion: Nov-10; PackageDescription: 5-Pin Plastic (Green) Transistor Single Outline Package, 6.5 x 6.12 mm Body, 1.14 mm Pitch; Halogen-free: TRUE; DatasheetVersion: Rev. 1.0; PackageReference: PG-TO252-5-11; ton (max): 500 us

## Sheet TAJ1051T.SchDoc
size A4
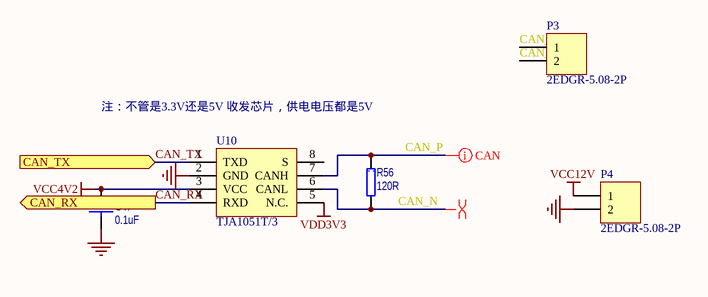
[diagram p2: TAJ1051T.SchDoc]

### Parts
C47  0.1uF  [2012[0805]06CD]
P3  2EDGR-5.08-2P  [2EDGR-5.08-2P]
P4  2EDGR-5.08-2P  [2EDGR-5.08-2P]
R56  120R  [2012[0805]R]
U10  TJA1051T/3  [SOIC8_N]

### Ports
CAN_RX (out), CAN_TX (in)

### Nets
GND: C47.2 P4.2 U10.2(GND)
VCC4V2: C47.1 U10.3(VCC)
VCC12V: P4.1
VDD3V3: U10.5(N.C.)
CAN_N: P3.2 R56.2 U10.6(CANL)
CAN_P: P3.1 R56.1 U10.7(CANH)
CAN_RX: U10.4(RXD) ; port CAN_RX
CAN_TX: U10.1(TXD) ; port CAN_TX

Not connected (* = marked no-connect by the designer): U10 8(S)

### Layout directives
differential pair: CAN_N, CAN_P

### Notes on the sheet
- (near U10) 注：不管是3.3V还是5V 收发芯片，供电电压都是5V

### Library data of the parts
C47 = CAP: Capacitor; Manufacturer: TDK; Type: 无铅电容; Model: C0603X7R1H104K; Value: 0.1uF
P3 P4 = Header 2: Header, 2-Pin; LatestRevisionDate: 17-Jul-2002; LatestRevisionNote: Re-released for DXP Platform.; Publisher: Altium Limited
R56 = RES: Manufacturer: vishay; Model: RT0603DRD7D120RL; Value: 120R; Type: 无铅电阻
U10 = TJA1051T/3: IC; 公司: NXP

## Sheet W5500+HR911105A.SchDoc
size A4
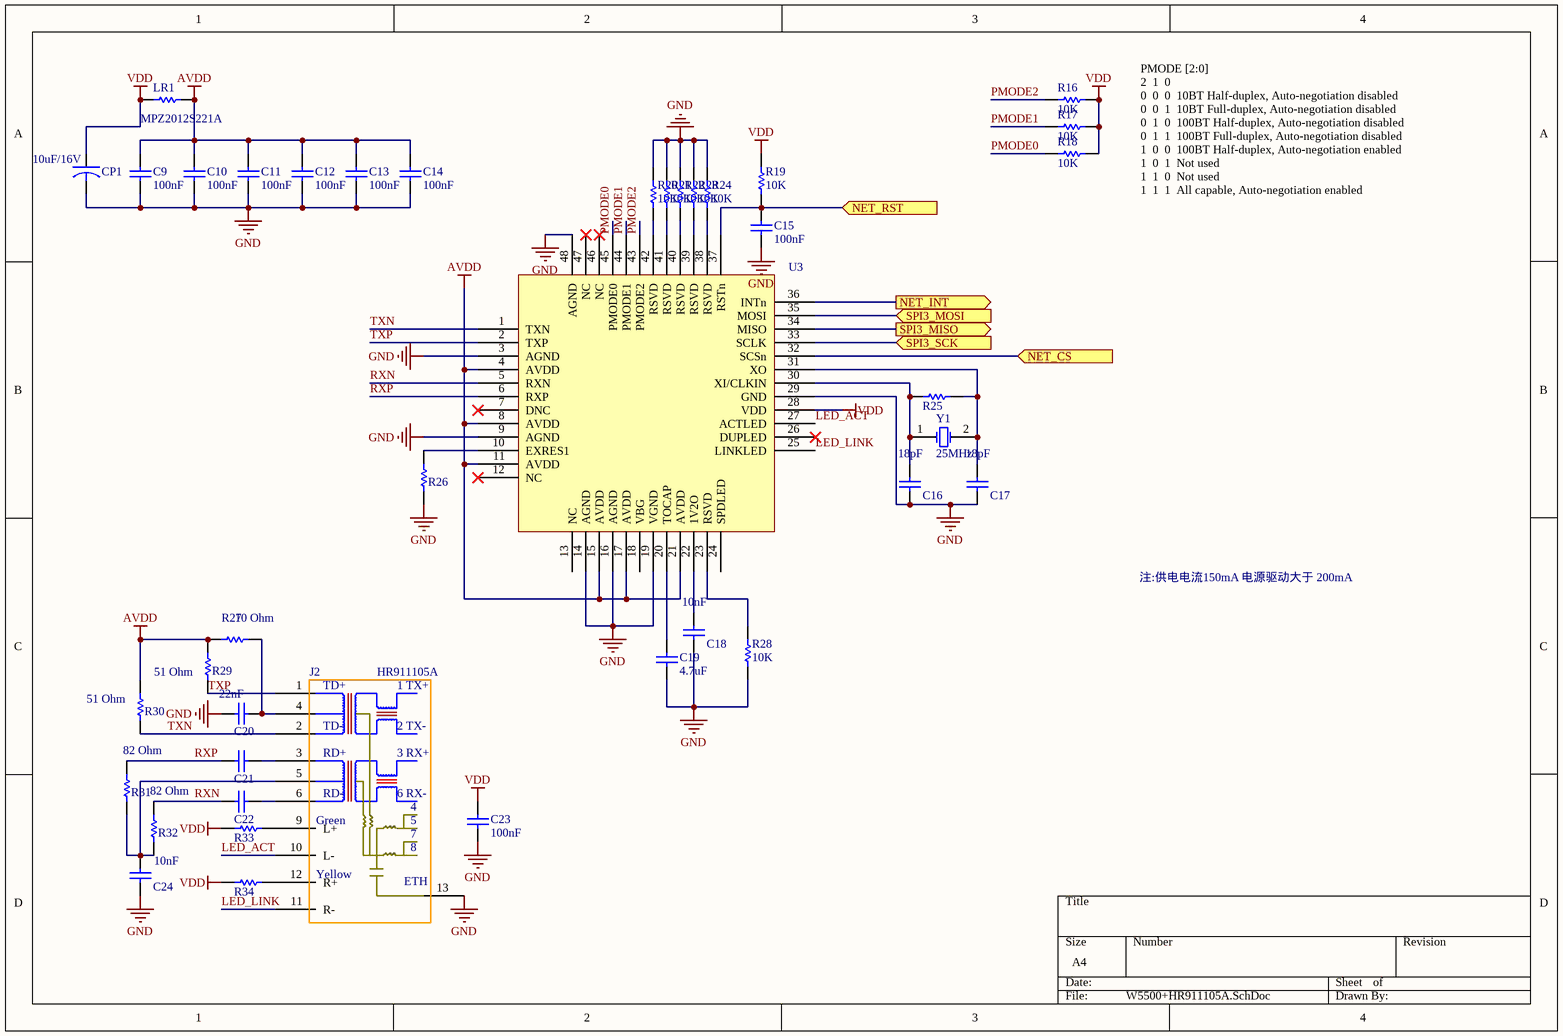
[diagram p3: W5500+HR911105A.SchDoc]

### Parts
C9  value 100nF  [2012[0805]06CD]  (hidden comment: CAP 100nF 50V 0805(2012))
C10  value 100nF  [2012[0805]06CD]  (hidden comment: CAP 100nF 50V 0805(2012))
C11  value 100nF  [2012[0805]06CD]  (hidden comment: CAP 100nF 50V 0805(2012))
C12  value 100nF  [2012[0805]06CD]  (hidden comment: CAP 100nF 50V 0805(2012))
C13  value 100nF  [2012[0805]06CD]  (hidden comment: CAP 100nF 50V 0805(2012))
C14  value 100nF  [2012[0805]06CD]  (hidden comment: CAP 100nF 50V 0805(2012))
C15  value 100nF  [2012[0805]06CD]  (hidden comment: CAP 100nF 50V 0805(2012))
C16  value 18pF  [2012[0805]100_L]  (hidden comment: CAP 18pF 50V 0805(2012))
C17  value 18pF  [2012[0805]100_L]  (hidden comment: CAP 18pF 50V 0805(2012))
C18  value 10nF  [2012[0805]100_L]  (hidden comment: CAP 10nF 50V 0805(2012))
C19  value 4.7uF  [2012[0805]13CD]  (hidden comment: CAP 4.7uF 50V 0805(2012))
C20  value 22nF  [2012[0805]100_L]  (hidden comment: CAP 22nF 50V 0805(2012))
C21  CAP 6.8nF 50V 0805(2012)  [2012[0805]100_L]  (value not drawn)
C22  CAP 6.8nF 50V 0805(2012)  [2012[0805]100_L]  (value not drawn)
C23  value 100nF  [2012[0805]06CD]  (hidden comment: CAP 100nF 50V 0805(2012))
C24  value 10nF  [2012[0805]100_L]  (hidden comment: CAP 10nF 50V 0805(2012))
CP1  value 10uF/16V  [3216[1206]CB]  (hidden comment: TAJA106K016RNJ)
J2  HR911105A  [HR911105A]
LR1  MPZ2012S221A  [2012[0805]RL]
R16  value 10K  [2012[0805]R]  (hidden comment: 10K 1% 0805(2012))
R17  value 10K  [2012[0805]R]  (hidden comment: 10K 1% 0805(2012))
R18  value 10K  [2012[0805]R]  (hidden comment: 10K 1% 0805(2012))
R19  value 10K  [2012[0805]R]  (hidden comment: 10K 1% 0805(2012))
R20  value 10K  [2012[0805]R]  (hidden comment: 10K 1% 0805(2012))
R21  value 10K  [2012[0805]R]  (hidden comment: 10K 1% 0805(2012))
R22  value 10K  [2012[0805]R]  (hidden comment: 10K 1% 0805(2012))
R23  value 10K  [2012[0805]R]  (hidden comment: 10K 1% 0805(2012))
R24  value 10K  [2012[0805]R]  (hidden comment: 10K 1% 0805(2012))
R25  1M 1% 0805(2012)  [2012[0805]R]  (value not drawn)
R26  12K4 1% 0805(2012)  [2012[0805]R]  (value not drawn)
R27  value 10 Ohm  [2012[0805]R]  (hidden comment: 10R 5% 0805(2012))
R28  value 10K  [2012[0805]R]  (hidden comment: 10K 1% 0805(2012))
R29  value 51 Ohm  [2012[0805]R]  (hidden comment: 51R 5% 0805(2012))
R30  value 51 Ohm  [2012[0805]R]  (hidden comment: 51R 5% 0805(2012))
R31  value 82 Ohm  [2012[0805]R]  (hidden comment: 82R 5% 0805(2012))
R32  value 82 Ohm  [2012[0805]R]  (hidden comment: 82R 5% 0805(2012))
R33  270R 5% 0805(2012)  [2012[0805]R]  (value not drawn)
R34  270R 5% 0805(2012)  [2012[0805]R]  (value not drawn)
U3  W5500  [LQFP48_N]  (value not drawn)
Y1  25MHz  [XTAL_HC-49]

### Ports
NET_CS (in), NET_INT (out), NET_RST (in), SPI3_MISO (out), SPI3_MOSI (in), SPI3_SCK (in)

### Nets
AVDD: C9.1 C10.1 C11.1 C12.1 C13.1 C14.1 LR1.1 R27.2 R29.2 R30.2 U3.4(AVDD) U3.8(AVDD) U3.11(AVDD) U3.15(AVDD) U3.17(AVDD) U3.21(AVDD)
GND: C9.2 C10.2 C11.2 C12.2 C13.2 C14.2 C15.2 C16.1 C17.1 C18.1 C19.2 C20.1 C23.2 C24.1 CP1.2 J2.13 R20.1 R21.1 R22.1 R23.1 R24.1 R26.1 R28.2 U3.3(AGND) U3.9(AGND) U3.14(AGND) U3.16(AGND) U3.19(VGND) U3.29(GND) U3.48(AGND)
VDD: C23.1 CP1.1 LR1.2 R16.1 R17.1 R18.1 R19.1 R33.1 R34.1 U3.28(VDD)
LED_ACT: J2.10(L-) U3.27(ACTLED)
LED_LINK: J2.11(R-) U3.25(LINKLED)
PMODE0: R18.2 U3.45(PMODE0)
PMODE1: R17.2 U3.44(PMODE1)
PMODE2: R16.2 U3.43(PMODE2)
RXN: C22.1 R32.2 U3.5(RXN)
RXP: C21.1 R31.2 U3.6(RXP)
TXN: J2.2 R30.1 U3.1(TXN)
TXP: J2.1 R29.1 U3.2(TXP)
NetC15_1: C15.1 R19.2 U3.37(RSTn) ; port NET_RST
NetC16_2: C16.2 R25.1 U3.30(XI/CLKIN) Y1.1(OSC1)
NetC17_2: C17.2 R25.2 U3.31(XO) Y1.2(OSC2)
NetC18_2: C18.2 U3.22(1V2O)
NetC19_1: C19.1 U3.20(TOCAP)
NetC20_2: C20.2 J2.4 R27.1
NetC21_2: C21.2 J2.3
NetC22_2: C22.2 J2.6
NetC24_2: C24.2 J2.5 R31.1 R32.1
NetJ2_9: J2.9(L+) R33.2
NetJ2_12: J2.12(R+) R34.2
NetR20_2: R20.2 U3.42(RSVD)
NetR21_2: R21.2 U3.41(RSVD)
NetR22_2: R22.2 U3.40(RSVD)
NetR23_2: R23.2 U3.39(RSVD)
NetR24_2: R24.2 U3.38(RSVD)
NetR26_2: R26.2 U3.10(EXRES1)
NetR28_1: R28.1 U3.23(RSVD)
NetU3_32: U3.32(SCSn) ; port NET_CS
NetU3_33: U3.33(SCLK) ; port SPI3_SCK
NetU3_34: U3.34(MISO) ; port SPI3_MISO
NetU3_35: U3.35(MOSI) ; port SPI3_MOSI
NetU3_36: U3.36(INTn) ; port NET_INT

Not connected (* = marked no-connect by the designer): U3 7(DNC)* 12(NC)* 13(NC) 18(VBG) 24(SPDLED) 26(DUPLED)* 46(NC)* 47(NC)*

### Notes on the sheet
- PMODE [2:0]
  2  1  0
  0  0  0  10BT Half-duplex, Auto-negotiation disabled
  0  0  1  10BT Full-duplex, Auto-negotiation disabled
  0  1  0  100BT Half-duplex, Auto-negotiation disabled
  0  1  1  100BT Full-duplex, Auto-negotiation disabled
  1  0  0  100BT Half-duplex, Auto-negotiation enabled
  1  0  1  Not used
  1  1  0  Not used
  1  1  1  All capable, Auto-negotiation enabled
- 注:供电电流150mA 电源驱动大于 200mA
- (in symbol HR911102) TD+; 1 TX+; TD-; 2 TX-; RD+; 3 RX+; RD-; 6 RX-; Green; 7; 8; Yellow; ETH

### Library data of the parts
C9-C14 C23 = CMP-1036-04418-1: as C25 on sheet CPU; Tolerance: ±5%; Max Thickness: 1 mm; Technology: SMT; Rated Voltage: 50 V
C15 = CMP-1036-04417-1: as C33 on sheet CPU; Max Thickness: 1.45 mm; Tolerance: ±5%; Rated Voltage: 50 V; Technology: SMT
C16 C17 = CMP-1036-01136-1: as C34 on sheet CPU; Technology: SMT; Tolerance: ±1%; Max Thickness: 0.75 mm; Rated Voltage: 50 V
C18 C24 = CMP-1036-03837-1: CAP 10nF 50V ±1% 0805 (2012 Metric) Thickness 1mm SMD; Case-Metric: 2012; Case-EIA: 0805; Tolerance: ±1%; Rated Voltage: 50 V; Max Thickness: 1 mm; Technology: SMT
C19 = CMP-1036-04900-1: CAP 4.7uF 50V ±10% 0805 (2012 Metric) Thickness 1.45mm SMD; Case-Metric: 2012; Case-EIA: 0805; Tolerance: ±10%; Technology: SMT; Max Thickness: 1.45 mm; Rated Voltage: 50 V
C20 = CMP-1036-04061-1: CAP 22nF 50V ±5% 0805 (2012 Metric) Thickness 1.2mm SMD; Case-Metric: 2012; Case-EIA: 0805; Max Thickness: 1.2 mm; Rated Voltage: 50 V; Technology: SMT; Tolerance: ±5%
C21 C22 = CMP-1036-03703-1: CAP 6.8nF 50V ±1% 0805 (2012 Metric) Thickness 1mm SMD; Case-Metric: 2012; Case-EIA: 0805; Value: 6.8nF; Tolerance: ±1%; Max Thickness: 1 mm; Technology: SMT; Rated Voltage: 50 V
CP1 = CAPACITOR: as CP2 on sheet CPU; Category: 钽质电容器-固体SMD; ComponentLink1Description: http://www.avx.com/docs/Catalogs/taj.pdf; ComponentLink1URL: http://www.avx.com/docs/Catalogs/taj.pdf; Description 1: 钽质电容器-固体SMD 16volts 10uF 10%; Manufacturer Part Number: TAJA106K016RNJ; Minimum Order Quantity: 1; Pricing 1: 1=0.600, 100=0.280, 200=0.250, 500=0.221, 1000=0.200, 2000=0.140, 5000=0.131, 10000=0.124, 25000=0.103 (USD); Reeling: True; RoHS - 贸泽: Y; RoHS: RoHS Compliant; Stock 1: 20335; Supplier 1: Mouser; Supplier Part Number 1: 581-TAJA106K016R; 制造商: AVX; 容差: 10 %; 电容: 10 uF
J2 = HR911102
LR1 = Res Semi: as LR2 on sheet CPU; Supplier 1: Mouser; Supplier Part Number 1: 810-MPZ2012S221A; Manufacturer Part Number: MPZ2012S221A; RoHS: RoHS Compliant; Description 1: 电磁干扰滤波珠子、扼流圈和阵列 Ferrite Chip Beads; Category: 电磁干扰滤波珠子、扼流圈和阵列; Stock 1: 26540; Pricing 1: 1=0.070, 50=0.060, 100=0.053, 500=0.040, 1000=0.035, 4000=0.031, 8000=0.029, 12000=0.025 (USD); 制造商: TDK; RoHS - 贸泽: Y; Minimum Order Quantity: 1; Reeling: True; ComponentLink1URL: http://www.mouser.com/ds/2/400/e9413_mpz-24582.pdf; ComponentLink1Description: http://www.mouser.com/ds/2/400/e9413_mpz-24582.pdf
R16-R24 R28 = CMP-1013-00623-1: as R36 on sheet CPU; Tolerance: 1 %; Power: 0.125 W; Technology: SMT
R25 = CMP-1013-00849-1: 1M 0.125W 1% 0805 (2012 Metric)  SMD; Value: 1000000.00 Ohm; Case-Metric: 2012; Case-EIA: 0805; Technology: SMT; Power: 0.125 W; Tolerance: 1 %
R26 = CMP-1013-00633-1: 12K4 0.125W 1% 0805 (2012 Metric)  SMD; Case-EIA: 0805; Case-Metric: 2012; Power: 0.125 W; Tolerance: 1 %; Technology: SMT; Value: 12K4
R27 = CMP-1013-00026-1: as R40 on sheet CPU; Technology: SMT; Power: 0.125 W; Tolerance: 5 %
R29 R30 = CMP-1013-00043-1: 51R 0.125W 5% 0805 (2012 Metric)  SMD; Case-Metric: 2012; Case-EIA: 0805; Technology: SMT; Tolerance: 5 %; Power: 0.125 W
R31 R32 = CMP-1013-00048-1: 82R 0.125W 5% 0805 (2012 Metric)  SMD; Case-EIA: 0805; Case-Metric: 2012; Power: 0.125 W; Tolerance: 5 %; Technology: SMT
R33 R34 = CMP-1013-00060-1: 270R 0.125W 5% 0805 (2012 Metric)  SMD; Value: 270.00 Ohm; Case-Metric: 2012; Case-EIA: 0805; Power: 0.125 W; Technology: SMT; Tolerance: 5 %
U3 = W5500: 以太网
Y1 = XTAL: Crystal Oscillator; Published: 8-Jun-2000; LatestRevisionDate: 17-Jul-2002; LatestRevisionNote: Re-released for DXP Platform.; Publisher: Altium Limited

## Sheet LM2596.SchDoc
size A4
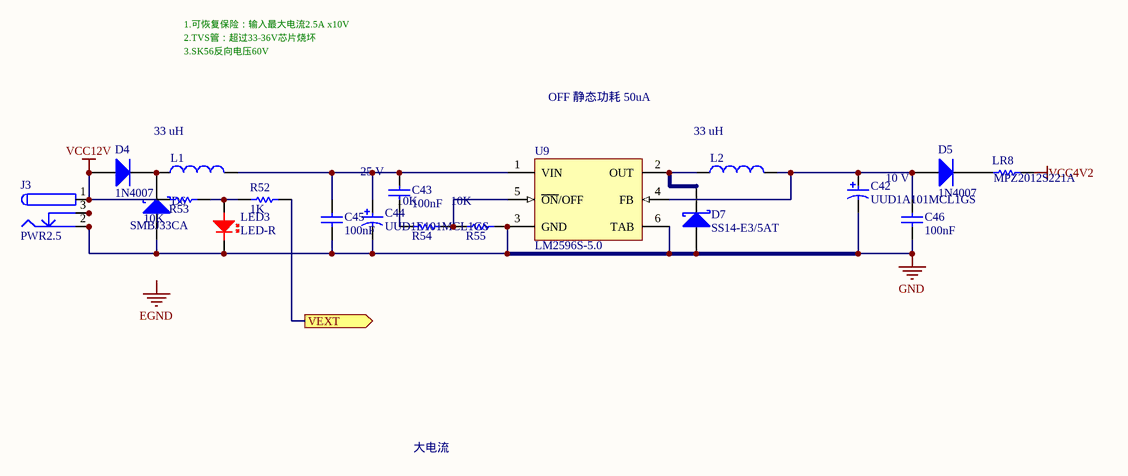
[diagram p4: LM2596.SchDoc]

### Parts
C42  UUD1A101MCL1GS  Rated Voltage: 10 V  [NIC-CAPA2-6.3X5.8_V]
C43  value 100nF  [2012[0805]06CD]  (hidden comment: CAP 100nF 50V 0805(2012))
C44  UUD1E101MCL1GS  Rated Voltage: 25 V  [NIC-CAPA2-6.3X7.7_V]
C45  value 100nF  [2012[0805]06CD]  (hidden comment: CAP 100nF 50V 0805(2012))
C46  value 100nF  [2012[0805]06CD]  (hidden comment: CAP 100nF 50V 0805(2012))
D4  1N4007  [DO-214AC/SMA]
D5  1N4007  [DO-214AC/SMA]
D6  SMBJ33CA  [DO-214AA/SMB]
D7  SS14-E3/5AT  [VISH-DO-214AC-2_V]
J3  PWR2.5  [KLD-0202]
L1  Inductance: 33 uH  [INDP5050X28N]  (hidden comment: SLF7045T-330M1R1-H)
L2  Inductance: 33 uH  [INDP5050X28N]  (hidden comment: SLF7045T-330M1R1-H)
LED3  LED-R  [0805LED]
LR8  MPZ2012S221A  [2012[0805]RL]
R52  value 1K  [2012[0805]R]  (hidden comment: 1K 1% 0805(2012))
R53  value 10K  [2012[0805]R]  (hidden comment: 10K 1% 0805(2012))
R54  value 10K  [2012[0805]R]  (hidden comment: 10K 1% 0805(2012))
R55  value 10K  [2012[0805]R]  (hidden comment: 10K 1% 0805(2012))
U9  LM2596S-5.0  [TS5B_N]

### Ports
VEXT (out)

### Nets
GND: C42.2 C44.2 C45.2 C46.2 D6.1(A) D7.1(A) J3.2 J3.2A J3.2B LED3.2 R55.2 U9.3(GND) U9.6(TAB)
VCC4V2: LR8.2
VCC12V: D4.1(A) J3.1 J3.1A J3.1B R53.1
NetC42_1: C42.1 C46.1 D5.1(A) L2.2 U9.4(FB)
NetC43_1: C43.1 C44.1 C45.1 L1.2 U9.1(VIN)
NetC43_2: C43.2 R54.1
NetD4_2: D4.2(K) D6.2(K) L1.1
NetD5_2: D5.2(K) LR8.1
NetD7_2: D7.2(K) L2.1 U9.2(OUT)
NetJ3_3: J3.3 J3.3A J3.3B
NetLED3_1: LED3.1 R52.2 R53.2
NetR52_1: R52.1 ; port VEXT
NetR54_2: R54.2 R55.1 U9.5(~{ON}/OFF)

### Notes on the sheet
- 1.可恢复保险：输入最大电流2.5A x10V
- 2.TVS管：超过33-36V芯片烧坏
- 3.SK56反向电压60V
- OFF 静态功耗 50uA
- 大电流
- Labels drawn without touching a wire or pin: EGND

### Library data of the parts
C42 = CMP-0687-00054-1: Aluminum Electrolytic Capacitor, UD Series, Low Impedance, 100 uF, 10 V, + / - 20%, -55 to 105 degC, Chip Type, 6.3 x 5.8 mm D x L, Pb-Free, Reel; Manufacturer: Nichicon; Endurance Time: 2000 h; Packing: Dia382mm Reel; Tolerance Rated Capacitance: -20 to 20%; Rated Capacitance: 100 uF; Impedance: 0.44 Ohm; Rated Ripple Current (at 100kHz): 230 mA; ComponentLink1Description: Manufacturer URL; RoHS: TRUE; ComponentLink2Description: Datasheet; PackageReference: CAPAE-D6.3H5.8; Length: 5.8 mm; DatasheetVersion: 08/2012; ComponentLink3URL: http://products.nichicon.co.jp/en/pdf/XJA043/e-ud.pdf; ComponentLink1URL: http://www.nichicon.co.jp/; ComponentLink2URL: http://products.nichicon.co.jp/en/pdf/XJA043/e-ud.pdf; PartNumber: UUD1A101MCL1GS; PackageDescription: 2-Pin Surface Mount Device, Diameter 6.3 mm, Height 5.8 mm, Pitch 5.4 mm; ComponentLink3Description: Package Specification; Mounting Technology: Surface Mount; Diameter: 6.3 mm
C43 C45 C46 = CMP-1036-04418-1: as C25 on sheet CPU; Tolerance: ±5%; Max Thickness: 1 mm; Technology: SMT; Rated Voltage: 50 V
C44 = CMP-0687-00063-1: Aluminum Electrolytic Capacitor, UD Series, Low Impedance, 100 uF, 25 V, + / - 20%, -55 to 105 degC, Chip Type, 6.3 x 7.7 mm D x L, Pb-Free, Reel; Manufacturer: Nichicon; Rated Ripple Current (at 100kHz): 280 mA; Endurance Time: 2000 h; Packing: Dia382mm Reel; Tolerance Rated Capacitance: -20 to 20%; Impedance: 0.34 Ohm; Rated Capacitance: 100 uF; PackageReference: CAPAE-D6.3H7.7; RoHS: TRUE; PackageDescription: 2-Pin Surface Mount Device, Diameter 6.3 mm, Height 7.7 mm, Pitch 5.4 mm; Mounting Technology: Surface Mount; ComponentLink3Description: Package Specification; Diameter: 6.3 mm; DatasheetVersion: 08/2012; PartNumber: UUD1E101MCL1GS; ComponentLink3URL: http://products.nichicon.co.jp/en/pdf/XJA043/e-ud.pdf; Length: 7.7 mm; ComponentLink2Description: Datasheet; ComponentLink2URL: http://products.nichicon.co.jp/en/pdf/XJA043/e-ud.pdf; ComponentLink1Description: Manufacturer URL; ComponentLink1URL: http://www.nichicon.co.jp/
D4 D5 = 1N4007: 1.0 Ampere General Purpose Rectifier; Published: 8-Jun-2000; LatestRevisionDate: 17-Jul-2002; LatestRevisionNote: Re-released for DXP Platform.; DatasheetDocument: 1998; PackageDocument: Aug-1999; PackageReference: DO-41; Publisher: Altium Limited; Code_JEDEC: DO-204-AL; ComponentLink1Description: Manufacturer Link; ComponentLink1URL: http://www.fairchildsemi.com/; ComponentLink2Description: Pinout Specification; ComponentLink2URL: http://www.fairchildsemi.com/ds/1N%2F1N4001.pdf
D6 = 30BQ040: TVS; Manufacturer: Fairchild Semiconductor; Type: Zener; Bidirectional Channels: 1; Voltage - Reverse Standoff (Typ): 33V; Voltage - Breakdown (Min): 36.7V; Voltage - Clamping (Max) @ Ipp: 53.3V; Current - Peak Pulse (10/1000µs): 11.3A; Power - Peak Pulse: 600W; Power Line Protection: No; Supplier 1: Digi-Key; Supplier Part Number 1: SMBJ33CAFSCT-ND; Manufacturer Part Number: SMBJ33CA; RoHS: RoHS Compliant; Category: Circuit Protection; Stock 1: 9879; Pricing 1: 1=0.58, 10=0.411, 25=0.3372, 100=0.2695, 250=0.19636, 500=0.15946, 1000=0.12257 (USD); Packaging: Cut Tape (CT); Unidirectional Channels: -; Applications: General Purpose; Capacitance @ Frequency: -; Operating Temperature: -55°C ~ 150°C (TJ); Mounting Type: Surface Mount; Package / Case: DO-214AA, SMB; Supplier Device Package: DO-214AA (SMB); ComponentLink1URL: http://www.fairchildsemi.com/datasheets/SM/SMBJ100A.pdf; ComponentLink1Description: http://www.fairchildsemi.com/datasheets/SM/SMBJ100A.pdf
D7 = CMP-0549-00004-1: Schottky Barrier Rectifier, 40 V Maximum DC Blocking Voltage, -65 to 125 degC, 2-Pin SMA Case, RoHS; Manufacturer: Vishay Semiconductor; IFSM: 40 A; IF(AV): 1 A Max.; VRRM: 40 V Max.; VRMS: 28 V Max.; PackageReference: DO-214AC-2; RoHS: TRUE; DatasheetVersion: 12/17/2012; ComponentLink1Description: Manufacturer URL; ComponentLink2URL: http://www.vishay.com/docs/88746/ss12.pdf; PartNumber: SS14-E3/5AT; PackageVersion: Dec-12; Operating Temperature: -65 to 125 degC; ComponentLink3URL: http://www.vishay.com/docs/88746/ss12.pdf; PackageDescription: 2-Pin SMD, Body 4.245 x 2.665 mm, Height 2.29 mm; ComponentLink1URL: http://www.vishay.com/; ComponentLink3Description: Package Specification; ComponentLink2Description: Datasheet; Mounting Technology: Surface Mount; VDC: 40 V Max.
J3 = PWR2.5: Low Voltage Power Supply Connector; Published: 17-Dec-2003; DatasheetDocument: 09-May-2002; Publisher: Altium Limited; ComponentLink1Description: Manufacturer Link; ComponentLink1URL: http://domino.kycon.com/internet/Products.html
L1 L2 = Inductor: 固定电感器 SMD Power Inductor; Manufacturer: TDK; Core Material: Ferrite; Maximum DC Current: 1.1 A; Maximum DC Resistance: 96 mOhms; Shielding: Shielded; Tolerance: 20 %; Type: Wound Ferrite Inductor for Power Circuits; Case Height: 4.5 mm; Case Length: 7 mm; Test Frequency: 100 kHz; Supplier 1: Mouser; Supplier Part Number 1: 810-SLF7045T330M1R1H; Manufacturer Part Number: SLF7045T-330M1R1-H; RoHS: RoHS Compliant; Category: Fixed Inductors; Stock 1: 17; Pricing 1: 1=1.84, 10=1.38, 100=1.06, 500=0.780, 1000=0.734, 2000=0.689, 10000=0.666, 25000=0.643 (AUD); Operating Temperature Range: - 40 C to + 105 C; Package / Case: 7045 metric; Packaging: Reel; Product: Power Inductors; Series: SLF; Termination Style: SMD/SMT; Brand: TDK; Case Width: 7 mm; Product Category: Magnetic Shielded SMD Inductors; Standard Pack Qty: 1000; RoHS - Mouser: Y; Minimum Order Quantity: 1; Reeling: True; ComponentLink1URL: http://www.mouser.com/catalog/specsheets/tdk_e531_slf.pdf; ComponentLink1Description: http://www.mouser.com/catalog/specsheets/tdk_e531_slf.pdf
LED3 = LED-RED: 红色LED
LR8 = Res Semi: as LR2 on sheet CPU; Supplier 1: Mouser; Supplier Part Number 1: 810-MPZ2012S221A; Manufacturer Part Number: MPZ2012S221A; RoHS: RoHS Compliant; Description 1: 电磁干扰滤波珠子、扼流圈和阵列 Ferrite Chip Beads; Category: 电磁干扰滤波珠子、扼流圈和阵列; Stock 1: 26540; Pricing 1: 1=0.070, 50=0.060, 100=0.053, 500=0.040, 1000=0.035, 4000=0.031, 8000=0.029, 12000=0.025 (USD); 制造商: TDK; RoHS - 贸泽: Y; Minimum Order Quantity: 1; Reeling: True; ComponentLink1URL: http://www.mouser.com/ds/2/400/e9413_mpz-24582.pdf; ComponentLink1Description: http://www.mouser.com/ds/2/400/e9413_mpz-24582.pdf
R52 = CMP-1013-00510-1: as R35 on sheet CPU; Tolerance: 1 %; Power: 0.125 W; Technology: SMT
R53-R55 = CMP-1013-00623-1: as R36 on sheet CPU; Tolerance: 1 %; Power: 0.125 W; Technology: SMT
U9 = LM2596S-5.0: SIMPLE SWITCHER?Power Converter 150 KHz 3A Step-Down Voltage Regulator, 5-pin TO-263; Manufacturer: National Semiconductor; PackageTopMarking: NSUZXYTTE#*LM2596S*-5.0 P+; PowerWise: N; High-Reliability: Y; DatasheetVersion: May-2002; PackageVersion: revD, Apr-2005; PackageReference: TS5B; PackageDescription: TO-263, Molded, .400 x .390 x .180in, 5 Lead, .067in Pitch, Surface Mount; PartNumber: LM2596S-5.0; RoHS: N; PinCount: 5; CompType: Switcher; Code_JEDEC: MO-169-AB; ComponentLink1Description: Manufacturer URL; ComponentLink1URL: http://www.national.com/; ComponentLink2Description: LM2596 Datasheet; ComponentLink2URL: http://www.national.com/ds/LM/LM2596.pdf; ComponentLink3Description: LM2596 Web Page; ComponentLink3URL: http://www.national.com/pf/LM/LM2596.html; ComponentLink4Description: TS5B Package Page; ComponentLink4URL: http://www.national.com/packaging/folders/ts5b.html